# Altium schematic sheet MSXIV_Discharge_Circuit.SchDoc
size Letter; Website: www.uwmidsun.com
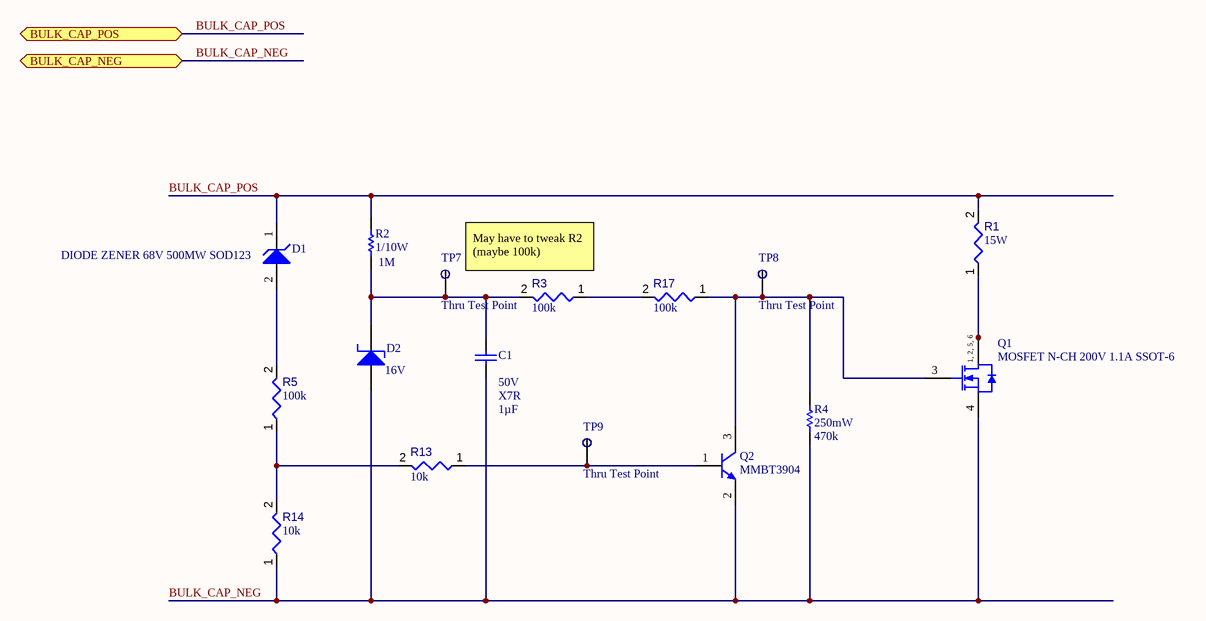
[diagram p0: MSXIV_Discharge_Circuit.SchDoc]

## Parts
C1  value 1µF  Voltage: 50V  Temperature Coefficient: X7R  [CAP, 0603]  (hidden comment: CAP CER 1UF 50V 10% X7R 0603)
D1  DIODE ZENER 68V 500MW SOD123  [ONSC-SOD-123-2-425-04_V]
D2  Voltage - Zener (Nom): 16V  [DO-214AA Diode]  (hidden comment: DIODE ZENER 16V 5W DO-214AA (SMB)_1)
Q1  MOSFET N-CH 200V 1.1A SSOT-6  [FAIR-SOT23-6_V]
Q2  MMBT3904  [FAIR-SOT23-3_V]
R1  Max Power Dissipation: 15W  [MP915-1.00K-1%-Footprint-1]  (hidden comment: RES 1K OHM 15W 1% TO126)
R2  Power (Watts): 1/10W  Resistance (Ohms): 1M  [RES, 0603]  (hidden comment: RES 1M OHM 1% 1/10W 0603)
R3  value 100k  [RESC2013X70X40ML20T20]  (hidden comment: Resistor 100k +/-1% 0805 125 mW)
R4  value 470k  Max Power Dissipation: 250mW  [RES 1206]  (hidden comment: RES SMD 470K OHM 0.1% 1/4W 1206)
R5  value 100k  [RESC2013X70X40ML20T20]  (hidden comment: Resistor 100k +/-1% 0805 125 mW)
R13  value 10k  [RESC2013X50X35ML15T15]  (hidden comment: Resistor 10k +/-1% 0805 125 mW)
R14  value 10k  [RESC2013X50X35ML15T15]  (hidden comment: Resistor 10k +/-1% 0805 125 mW)
R17  value 100k  [RESC2013X70X40ML20T20]  (hidden comment: Resistor 100k +/-1% 0805 125 mW)
TP7  Thru Test Point  [Thru Test Point]
TP8  Thru Test Point  [Thru Test Point]
TP9  Thru Test Point  [Thru Test Point]

## Ports
BULK_CAP_NEG (bidir), BULK_CAP_POS (bidir)

## Nets
BULK_CAP_NEG: C1.2 D2.1(A) Q1.4(S) Q2.2(E) R4.2 R14.1 ; port BULK_CAP_NEG
BULK_CAP_POS: D1.1(K) R1.2 R2.1 ; port BULK_CAP_POS
NetC1_1: C1.1 D2.2(K) R2.2 R3.2 TP7.TH_TP
NetD1_2: D1.2(A) R5.2
NetQ1_1: Q1.1(D) Q1.2(D) Q1.5(D) Q1.6(D) R1.1
NetQ1_3: Q1.3(G) Q2.3(C) R4.1 R17.1 TP8.TH_TP
NetQ2_1: Q2.1(B) R13.1 TP9.TH_TP
NetR3_1: R3.1 R17.2
NetR5_1: R5.1 R13.2 R14.2

## Notes on the sheet
- May have to tweak R2 (maybe 100k)
- Project:
- Title:
- Size:
- Project Author
- Letter
- Revision:
- University of Waterloo
- 200 University Ave W
- Waterloo, ON, Canada
- N2L 3E9
- Date:
- Sheet
- of
- Website:
- (in symbol CMP-013-00034-1) 1, 2, 5, 6

## Library data of the parts
C1 = CMP-013-0013-1: 1µF ±10% 50V Ceramic Capacitor X7R 0603 (1608 Metric); Manufacturer Part Number 1: UMK107AB7105KA-T; Manufacturer 1: Taiyo Yuden; ComponentLink1Description: http://www.yuden.co.jp/productdata/catalog/en/mlcc_all_e.pdf; Ratings: -; Part Status: Active; Packaging: Cut Tape (CT); Source: Schematic Diagrams.SchLib; Operating Temperature: -55°C ~ 125°C; Package / Case: 0603 (1608 Metric); Thickness (Max): 0.037" (0.95mm); Mounting Type: Surface Mount, MLCC; Height - Seated (Max): -; Design Item ID: CAP CER 1UF 50V 10% X7R 0603; Lead Spacing: -; Tolerance: 10%; Lead Style: -; ComponentLink1URL: http://www.yuden.co.jp/productdata/catalog/en/mlcc_all_e.pdf; Size / Dimension: 0.063" L x 0.031" W (1.60mm x 0.80mm)
D1 = CMP-004-00031-1: Diode Zener Single 68V 5% 500mW Automotive 2-Pin SOD-123 T/R; Impedance: 230R; Max Reverse Leakage Current: 100nA; Lead Free: Lead Free; Case/Package: SOD-123-2; Radiation Hardening: No; Number of Pins: 2; Zener Voltage: 68V; Element Configuration: Single; Packaging: Tape and Reel; Min Operating Temperature: -55°C; Tolerance: 5%; Max Operating Temperature: 150°C; Package Quantity: 3000; Voltage Tolerance: 5%; Max Power Dissipation: 500mW
D2 = CMP-014-0016-1: Zener Diode 16V 5W ±5% Surface Mount DO-214AA (SMB); Manufacture: Micro Commercial Co; Manufacture Part Number: SMBJ5353B-TP; Impedence (Max): 2.5 Ohm; Voltage - Forward: 1.2V @ 1A; Power (Max): 5W; Design Item ID: DIODE ZENER 16V 5W DO-214AA (SMB)_1; Source: Schematic Diagrams.SchLib
Q1 = CMP-013-00034-1: Trans MOSFET N-CH 200V 1.1A 6-Pin SuperSOT T/R; On-State Resistance: 725MR; Threshold Voltage: 4V; Turn-On Delay Time: 6ns; Power Dissipation: 1.6W; Gate to Source Voltage (Vgs): 20V; Input Capacitance: 234pF; Element Configuration: Single; Turn-Off Delay Time: 17ns; Number of Elements: 1; Max Power Dissipation: 800mW; REACH SVHC: No SVHC; Drain to Source Voltage (Vdss): 200V; Number of Pins: 6; Height: 1mm; Voltage Rating (DC): 200V; Packaging: Tape and Reel; Lead Free: Lead Free; Mount: Surface Mount; Weight: 0.036g; Drain to Source Resistance: 725mR; Max Operating Temperature: 150°C; Drain to Source Breakdown Voltage: 200V; Min Operating Temperature: -55°C; Length: 3mm; Case/Package: SOT-23-6; Continuous Drain Current (ID): 1.1A; Rise Time: 6ns; Width: 1.7mm; Rds On Max: 725mR; Package Quantity: 1; Current Rating: 1.1A; Contact Plating: Tin,Matte; Fall Time: 6ns
Q2 = CMP-014-00026-1: NPN General Purpose Amplifier, 40 V, 0.2 A, -55 to 150 degC, 3-Pin SOT23, RoHS, Tape and Reel; Manufacturer: Fairchild Semiconductor; Package Version: Rev. 12, 03/2016; Power: 625mW; Elements: 1; Vce Max: 300mV; hFE Min: 100; Frequency: 300MHz; Max Operating Temperature: 150°C; Packaging: TapeandReel; Case/Package: TO-236-3; Package URL: http://www.fairchildsemi.com/dwg/MA/MA03D.pdf; Datasheet Version: Rev. 1.1.0, 10/2014; Package Description: 3-Pin Small Outline Transistor, Body 2.92 x 1.325 mm, Pitch 0.95 mm; Package Quantity: 3000; Datasheet URL: https://www.fairchildsemi.com/datasheets/MM/MMBT3904.pdf; Manufacturer URL: https://www.fairchildsemi.com/; RoHS Compliant: True; Mounting Technology: SM; Min Operating Temperature: -55°C; Pins: 3; Package Reference: SOT23-3
R1 = CMP-009-00177-1: 1 kOhms ±1% 15W Through Hole Resistor TO-126-2 Moisture Resistant, Non-Inductive Thick Film; Lead Diameter: 0.64mm; Lead Length: 11.4mm; Voltage Rating: 200V; Temperature Coefficient: 80ppm/°C; Resistance: 1kR; Lead Free: Lead Free; Width: 0.11inch; Tolerance: 1%; Min Operating Temperature: -55°C; Voltage Rating (DC): 200V; Case/Package: TO-126; Composition: Thick Film; Thickness: 0.01inch; Features: Moisture Resistant; REACH SVHC: No SVHC; Max Operating Temperature: 150°C; Mount: Through Hole; Packaging: Rail/Tube; Length: 8.12mm; Height: 0.45inch; Number of Terminations: 2; Depth: 2.79mm; Lead Pitch: 5.08mm; Package Quantity: 50; Termination: Radial; Power Rating: 15W
R2 = CMP-010-0007-1: 1M Ohm ±1% 0.1W, 1/10W Chip Resistor 0603 (1608 Metric) Moisture Resistant Thick Film; Manufacturer 1: Yageo; Manufacturer Part Number 1: RC0603FR-071ML; Description 1: RES SMD 1M OHM 1% 1/10W 0603; Temperature Coefficient: ±100ppm/°C; Supplier Device Package: 0603; Stock 1: 2336711; RoHS: RoHS Compliant; Source: Schematic Diagrams.SchLib; Size / Dimension: 0.063" L x 0.031" W (1.60mm x 0.80mm); Failure Rate: -; ComponentLink1URL: http://www.yageo.com/documents/recent/PYu-RC_Group_51_RoHS_L_7.pdf; Features: Moisture Resistant; Height - Seated (Max): 0.022" (0.55mm); Packaging: Cut Tape (CT); Operating Temperature: -55°C ~ 155°C; ComponentLink1Description: http://www.yageo.com/documents/recent/PYu-RC_Group_51_RoHS_L_7.pdf; Tolerance: 1%; Composition: Thick Film; Part Status: Active; Pricing 1: 1=0.16, 10=0.022, 100=0.0089, 1000=0.00402, 2500=0.00349 (CAD); Design Item ID: RES 1M OHM 1% 1/10W 0603; Package / Case: 0603 (1608 Metric)
R3 R5 R17 = CMP-009-00024-4: Chip Resistor, 100 KOhm, +/- 1%, 0.125 W, -55 to 155 degC, 0805 (2012 Metric); Power: 125mW; Voltage Rating: 150V; Case/Package: 0805; Pins: 2; RoHS Compliant: True; Mounting Technology: SM; Tolerance: 1%; Max Operating Temperature: 155°C; Min Operating Temperature: -55°C
R4 = CMP-010-0046-1: 470 kOhms ±0.1% 0.25W, 1/4W Chip Resistor 1206 (3216 Metric) Anti-Sulfur, Automotive AEC-Q200 Thin Film; Manufacturer Part Number: RG3216P-4703-B-T1; Manufacturer: Susumu; Power Rating: 125mW; Temperature Coefficient: 25ppm/°C; Voltage Rating: 150V; Voltage Rating (DC): 200V; ComponentLink2Description: https://datasheet.ciiva.com/2490/rg-rm-rgh-datasheet-2490489.pdf; Stock 1: 2986; Tolerance: 0.1%; Case/Package: 1206; Packaging: Tape and Reel; Max Operating Temperature: 155°C; ComponentLink2URL: https://datasheet.ciiva.com/2490/rg-rm-rgh-datasheet-2490489.pdf; Termination: SMD/SMT; Package Quantity: 1; Number of Terminations: 2; Length: 0.126inch; ComponentLink3URL: https://datasheet.ciiva.com/2490/rg-rm-rgh-datasheet-2490490.pdf; Case Code (Metric): 3216; Width: 0.063inch; Lead Free: Lead Free; Design Item ID: RES SMD 470K OHM 0.1% 1/4W 1206; ComponentLink3Description: https://datasheet.ciiva.com/2490/rg-rm-rgh-datasheet-2490490.pdf; Source: Schematic Diagrams.SchLib; Min Operating Temperature: -55°C; Pins: 2; ComponentLink4URL: https://datasheet.ciiva.com/12760/rg-rm-rgh-datasheet-12760397.pdf; ComponentLink1Description: https://datasheet.ciiva.com/2490/rg-rm-rgh-datasheet-2490488.pdf; Height: 0.02inch; ComponentLink4Description: https://datasheet.ciiva.com/12760/rg-rm-rgh-datasheet-12760397.pdf; ComponentLink1URL: https://datasheet.ciiva.com/2490/rg-rm-rgh-datasheet-2490488.pdf; Composition: Thin Film; Pricing 1: 1=0.66, 10=0.474, 100=0.2462 (USD)
R13 R14 = CMP-009-00018-4: Chip Resistor, 10 KOhm, +/- 1%, 125 mW, -55 to 155 degC, 0805 (2012 Metric); Power: 125mW; Voltage Rating: 150V; RoHS Compliant: True; Mounting Technology: SM; Pins: 2; Case/Package: 0805; Min Operating Temperature: -55°C; Max Operating Temperature: 155°C; Tolerance: 1%
TP7-TP9 = CMP-003-0176-1: Design Item ID: Thru Test Point; Source: Schematic Diagrams.SchLib